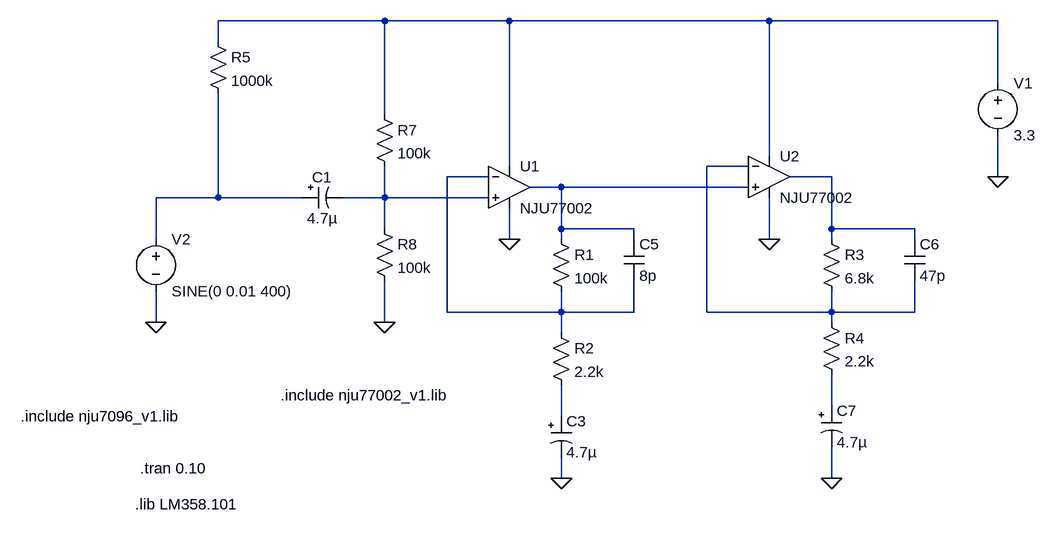
[diagram p0: schematic lm358_3.3v_all3.asc]
lm358_3.3v_all3.asc, the LTspice schematic file:
Version 4
SHEET 1 976 680
WIRE -448 -240 -704 -240
WIRE -256 -240 -448 -240
WIRE 144 -240 -256 -240
WIRE 496 -240 144 -240
WIRE -704 -208 -704 -240
WIRE 496 -144 496 -240
WIRE -448 -96 -448 -240
WIRE 144 -32 144 -240
WIRE -256 -16 -256 -240
WIRE 112 -16 48 -16
WIRE -288 0 -352 0
WIRE 240 0 176 0
WIRE 496 0 496 -64
WIRE -176 16 -224 16
WIRE 112 16 -176 16
WIRE -704 32 -704 -128
WIRE -704 32 -800 32
WIRE -576 32 -704 32
WIRE -448 32 -448 -16
WIRE -448 32 -512 32
WIRE -288 32 -448 32
WIRE -448 80 -448 32
WIRE -176 80 -176 16
WIRE -64 80 -176 80
WIRE 240 80 240 0
WIRE 368 80 240 80
WIRE -800 96 -800 32
WIRE -256 96 -256 48
WIRE -176 96 -176 80
WIRE -64 96 -64 80
WIRE 144 96 144 32
WIRE 240 96 240 80
WIRE 368 96 368 80
WIRE -352 208 -352 0
WIRE -176 208 -176 176
WIRE -176 208 -352 208
WIRE -64 208 -64 160
WIRE -64 208 -176 208
WIRE 48 208 48 -16
WIRE 240 208 240 176
WIRE 240 208 48 208
WIRE 368 208 368 160
WIRE 368 208 240 208
WIRE -800 224 -800 176
WIRE -448 224 -448 160
WIRE 240 224 240 208
WIRE -176 240 -176 208
WIRE 240 352 240 304
WIRE -176 368 -176 320
WIRE -176 464 -176 432
WIRE 240 464 240 416
FLAG -800 224 0
FLAG -256 96 0
FLAG 144 96 0
FLAG -448 224 0
FLAG -176 464 0
FLAG 240 464 0
FLAG 496 0 0
SYMBOL voltage -800 80 R0
WINDOW 123 0 0 Left 2
WINDOW 39 0 0 Left 2
SYMATTR InstName V2
SYMATTR Value SINE(0 0.01 400)
SYMBOL polcap -576 16 M90
WINDOW 0 0 32 VBottom 2
WINDOW 3 32 32 VTop 2
SYMATTR InstName C1
SYMATTR Value 4.7µ
SYMATTR Description Capacitor
SYMATTR Type cap
SYMATTR SpiceLine V=63 Irms=34m Rser=4.7 Lser=0
SYMBOL res -720 -224 R0
SYMATTR InstName R5
SYMATTR Value 1000k
SYMBOL res -464 -112 R0
SYMATTR InstName R7
SYMATTR Value 100k
SYMBOL res -464 64 R0
SYMATTR InstName R8
SYMATTR Value 100k
SYMBOL Opamps\\opamp2 144 -64 R0
SYMATTR InstName U2
SYMATTR Value NJU77002
SYMBOL res -192 80 R0
SYMATTR InstName R1
SYMATTR Value 100k
SYMBOL res -192 224 R0
SYMATTR InstName R2
SYMATTR Value 2.2k
SYMBOL res 224 80 R0
SYMATTR InstName R3
SYMATTR Value 6.8k
SYMBOL res 224 208 R0
SYMATTR InstName R4
SYMATTR Value 2.2k
SYMBOL polcap -192 368 R0
WINDOW 3 24 56 Left 2
SYMATTR Value 4.7µ
SYMATTR InstName C3
SYMATTR Description Capacitor
SYMATTR Type cap
SYMATTR SpiceLine V=50 Irms=81m Rser=2.2 Lser=0
SYMBOL cap -80 96 R0
SYMATTR InstName C5
SYMATTR Value 8p
SYMBOL cap 352 96 R0
SYMATTR InstName C6
SYMATTR Value 47p
SYMBOL voltage 496 -160 R0
WINDOW 123 0 0 Left 2
WINDOW 39 0 0 Left 2
SYMATTR InstName V1
SYMATTR Value 3.3
SYMBOL polcap 224 352 R0
WINDOW 3 24 56 Left 2
SYMATTR Value 4.7µ
SYMATTR InstName C7
SYMATTR Description Capacitor
SYMATTR Type cap
SYMATTR SpiceLine V=50 Irms=81m Rser=2.2 Lser=0
SYMBOL Opamps\\opamp2 -256 -48 R0
SYMATTR InstName U1
SYMATTR Value NJU77002
TEXT -824 448 Left 2 !.tran 0.10
TEXT -832 504 Left 2 !.lib LM358.101
TEXT -608 336 Left 2 !.include nju77002_v1.lib
TEXT -1008 368 Left 2 !.include nju7096_v1.lib

The netlist it stands for:
* lm358_3.3v_all3.asc
V2 N006 0 SINE(0 0.01 400)
C1 N006 N007 4.7µ V=63 Irms=34m Rser=4.7 Lser=0
R5 N001 N006 1000k
R7 N001 N007 100k
R8 N007 0 100k
XU2 N005 N002 N001 0 N004 NJU77002  ; pins In+ In- V+ V- OUT
R1 N005 N003 100k
R2 N003 N009 2.2k
R3 N004 N002 6.8k
R4 N002 N008 2.2k
C3 N009 0 4.7µ V=50 Irms=81m Rser=2.2 Lser=0
C5 N005 N003 8p
C6 N004 N002 47p
V1 N001 0 3.3
C7 N008 0 4.7µ V=50 Irms=81m Rser=2.2 Lser=0
XU1 N007 N003 N001 0 N005 NJU77002  ; pins In+ In- V+ V- OUT
.tran 0.10
.lib LM358.101
.include nju77002_v1.lib
.include nju7096_v1.lib
.backanno
.end